# EAGLE design waterLevelController (EAGLE 9.6.2)
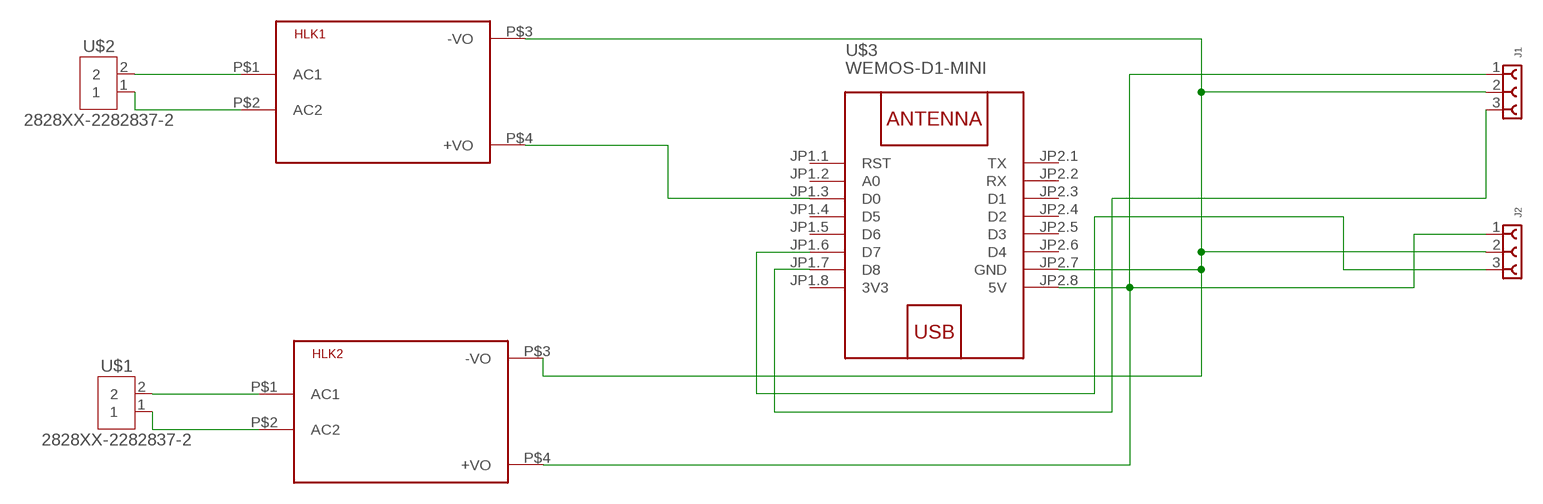
[diagram p0: schematic, sheet 1]

## Parts
HLK1  HLK-PM013W  [HLK-PM01]
HLK2  HLK-PM013W  [HLK-PM01]
J1  6130XX11821_61300311821  [61300311821]
J2  6130XX11821_61300311821  [61300311821]
U$1  2828XX-2282837-2  [TERMBLK_508-2N]
U$2  2828XX-2282837-2  [TERMBLK_508-2N]
U$3  WEMOS-D1-MINI  [WEMOS-D1-MINI]

## Nets
N$1: HLK1.P$2(AC2) U$2.1
N$2: HLK2.P$4(+VO) J1.1 J2.1 U$3.JP2.8(5V)
N$3: HLK1.P$1(AC1) U$2.2
N$4: HLK1.P$3(-VO) HLK2.P$3(-VO) J1.2 J2.2 U$3.JP2.7(GND)
N$5: HLK2.P$2(AC2) U$1.1
N$6: HLK2.P$1(AC1) U$1.2
N$7: HLK1.P$4(+VO) U$3.JP1.3(D0)
N$8: J1.3 U$3.JP1.7(D8)
N$9: J2.3 U$3.JP1.6(D7)
Unconnected: U$3.JP1.1(RST) U$3.JP1.2(A0) U$3.JP1.4(D5) U$3.JP1.5(D6) U$3.JP2.1(TX) U$3.JP2.2(RX) U$3.JP2.3(D1) U$3.JP2.4(D2) U$3.JP2.5(D3) U$3.JP2.6(D4)

## Power pins joined to a net without a drawn wire
3V3: U$3.JP1.8(3V3)

## Library data of the parts
HLK1 HLK2 = module:HLK-PM01: Hi-Link Power Supply HLK-PM01 3W Author: Ahmed Said <https://github.com/AhmedSaid/EAGLELibraries>
J1 J2 = Wurth_Connectors_WR-PHD:6130XX11821_61300311821: WR-PHD 2.54 mm Socket Header ARTICLE PROPERTIES: Pins:1;​ 2;​ 3;​ 4;​ 5;​ 6;​ 7;​ 8;​ 9;​ 10;​ 12;​ 13;​ 14;​ 15;​ 16;​ 18;​ 20;​ 22;​ 24;​ 25;​ 32;​ 36;​ 40 KIND PROPERTIES: Pitch：2.54 mm Quality Class:3 as per CECC 75 301-802 Rows：Single Gender：Socket Header;​ Female Type：Straight MATERIAL PROPERTIES: Insulator Material :PBT Insulator Flammability Rating:UL94 V-0 Contact Material:Copper Alloy Contact Plating:Gold Contact Type:Stamped GENERAL INFORMATION Operating Temperature:-40 up to +125 °C Compliance:Lead free / RoHS ELECTRICAL PROPERTIES: Rated Current:3 A IR 1:3 A Withstanding Voltage:500 V (AC) Contact Resistance:20 mΩ RISO:1000 MΩ CERTIFICATION UL Approval:E323964 PACKAGING PROPERTIES Packaging:Tray <https://katalog.we-online.com/media/images/v2/o33218v209%20Family_WR-PHD_613xxx11821.jpg> Details see: https://katalog.we-online.com/en/em/PHD_2_54_SOCKET_HEADER_6130XX11821 Updated by Yingchun,Shan 2019-10-21 2019 (C) Würth Elektronik; DATASHEET-URL: https://katalog.we-online.com/em/datasheet/61300311821.pdf; GENDER: Socket Header; IR: 3A; MATES: WR-PHD 2.54mm SMT Pin Header/THT Angled Pin Header/THT Pin Header; PACKAGING: Tray; PART-NUMBER: 61300311821; PINS: 3; ROWS: Single; TYPE: Straight
U$1 U$2 = Connector:2828XX-2: 2 Position Wire to Board Terminal Block Horizontal with Board Datasheet <https://www.te.com.cn/commerce/DocumentDelivery/DDEController?Action=showdoc&DocId=Catalog+Section%7F1308389_EUROSTYLE_TERMINAL_BLOCKS%7F0607%7Fpdf%7FEnglish%7FENG_CS_1308389_EUROSTYLE_TERMINAL_BLOCKS_0607.pdf%7F2-282837-5>; CATEGORY: Connector; DESCRIPTION: 2 Position Wire to Board Terminal Block Horizontal with Board 5.08 mm Through Hole; MANUFACTURER: TE Connectivity; MPN: 282837-2; OPERATING_TEMPERATURE: -40°C to +105°C; PART_STATUS: ACTIVE; ROHS_COMPLIANCE: RoHS Compliant; SERIES: 282837; SUBCATEGORY: Terminal Block; TYPE: Side Wire Entry
U$3 = diy-modules:WEMOS-D1-MINI: WEMOS D1 mini: Mini Wi-Fi Board based on ESP-8266 device More details can be found here: https://www.wemos.cc/product/d1-mini.html Click here to find device on ebay.com <http://www.ebay.com/sch/wemos+d1+mini+nodemcu>

## Board
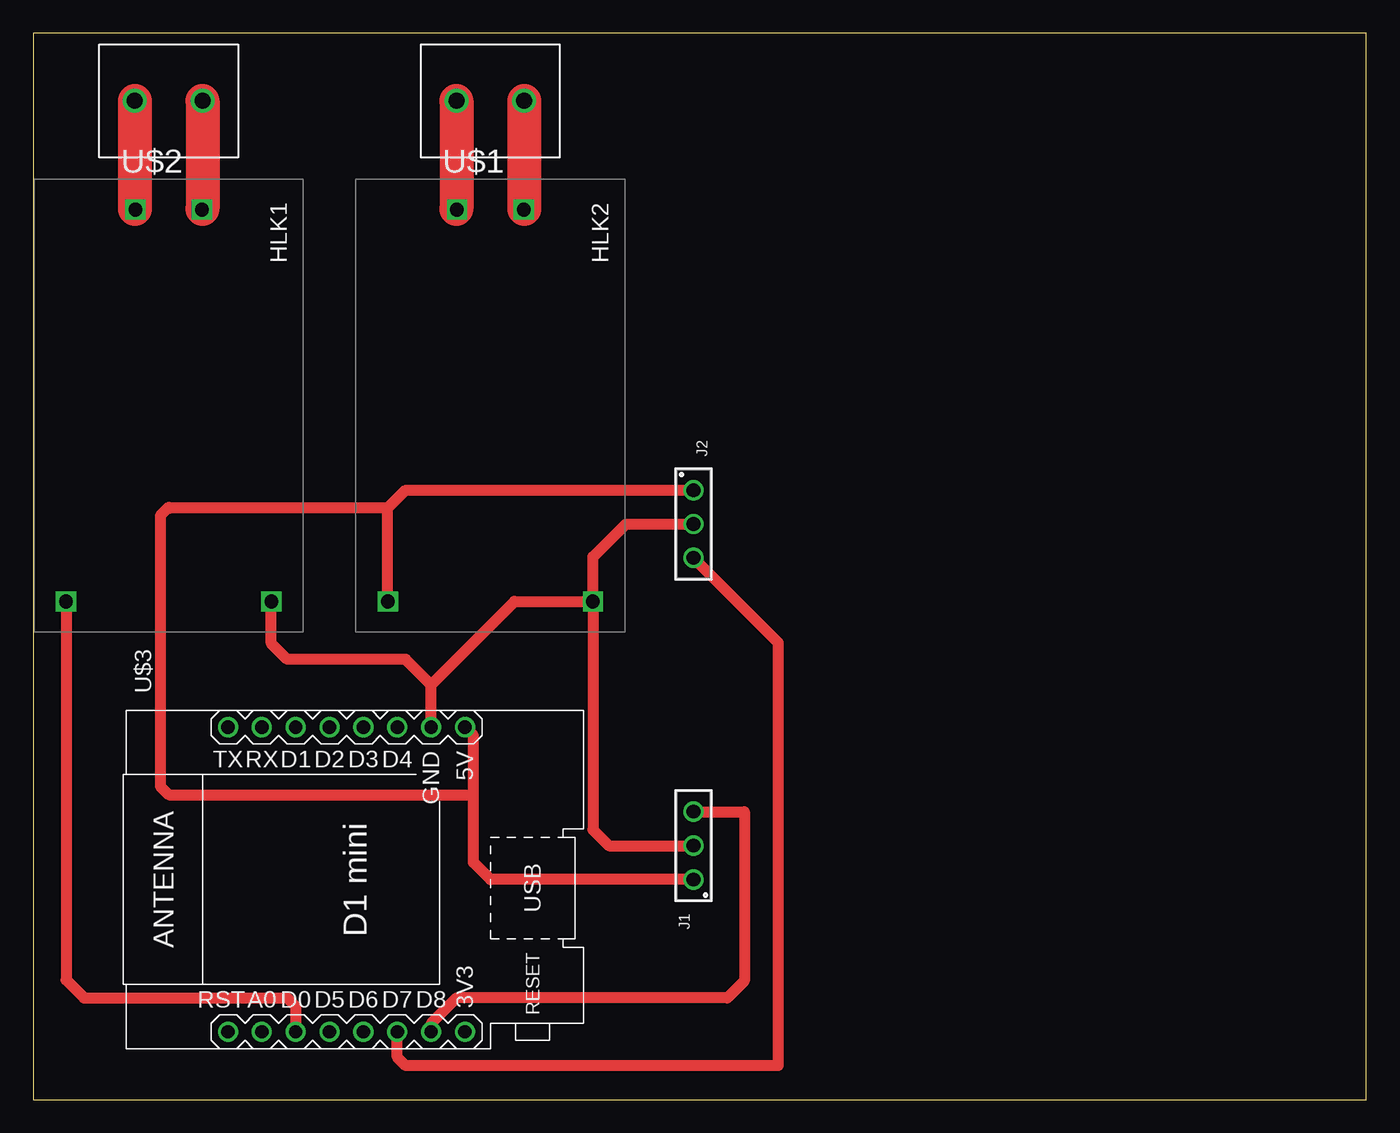
[diagram p1: board, top side]

Size 100 x 80 mm. Coordinates in mm from the lower left corner, seen from the top.
Outline: 0,0 100,0 100,80 0,80 0,0
Copper layers (1*16): Top 0.035mm / dielectric 1.5mm / Bottom 0.035mm
Design rules "default": minimum track width 6mil, minimum drill 0.35mm, track to track 6mil, track to pad 6mil, pad to pad 6mil, via to via 6mil, smd to smd 6mil, copper to edge 40mil, drill to drill 6mil, minimum pad ring 10mil, minimum via ring 8mil, stop-mask expansion 4mil, vias tented up to drill 0mil, thermal gap 10mil

### Footprints (pad centres in the part's own frame; a part is rotated, then mirrored left to right if it is on the bottom)
HLK-PM01 = drill 1.016 square: P$1 -14.7,2.5; P$2 -14.7,-2.5; P$3 14.7,7.7; P$4 14.7,-7.7
61300311821 = drill 1.02: 1 -2.54,0; 2 0,0; 3 2.54,0
TERMBLK_508-2N = drill 1.2: 1 0,0; 2 5.08,0
WEMOS-D1-MINI = drill 1: JP1.1 -11.43,9.525; JP1.2 -11.43,6.985; JP1.3 -11.43,4.445; JP1.4 -11.43,1.905; JP1.5 -11.43,-0.635; JP1.6 -11.43,-3.175; JP1.7 -11.43,-5.715; JP1.8 -11.43,-8.255; JP2.1 11.43,9.525; JP2.2 11.43,6.985; JP2.3 11.43,4.445; JP2.4 11.43,1.905; JP2.5 11.43,-0.635; JP2.6 11.43,-3.175; JP2.7 11.43,-5.715; JP2.8 11.43,-8.255

### Placement (x,y rotation side)
HLK1  10.16,52.07 270 top
HLK2  34.29,52.07 270 top
J1  49.53,19.05 90 top
J2  49.53,43.18 270 top
U$1  31.75,74.93 0 top
U$2  7.62,74.93 0 top
U$3  24.13,16.51 90 top

### Tracks (layer width: path | path; a pad name or v marks a point on that pad's centre or on a via)
N$1
  Top 0.152: 7.62,66.83 HLK1.P$2
  Top 2.54: U$2.1 7.62,66.83
N$2
  Top 0.813: HLK2.P$4 26.59,44.37 | 26.59,44.37 27.94,45.72 J2.1 | 26.59,44.37 10.24,44.37 10.16,44.45 9.53,43.81 9.53,23.5 10.16,22.86 33.02,22.86 | 33.02,22.86 33.02,27.3 U$3.JP2.8 | J1.1 34.29,16.51 33.02,17.78 33.02,22.86
N$3
  Top 0.152: 12.7,66.83 HLK1.P$1
  Top 2.54: U$2.2 12.7,66.83
N$4
  Top 0.813: U$3.JP2.7 29.84,31.11 | HLK2.P$3 36.1,37.37 29.84,31.11 | HLK2.P$3 41.99,40.72 44.45,43.18 J2.2 | HLK2.P$3 41.99,20.24 43.18,19.05 J1.2 | 29.84,31.11 27.94,33.02 19.05,33.02 17.86,34.21 HLK1.P$3
N$5
  Top 0.152: 31.75,66.83 HLK2.P$2
  Top 2.54: U$1.1 31.75,66.83
N$6
  Top 0.152: 36.83,66.83 HLK2.P$1
  Top 2.54: U$1.2 36.83,66.83
N$7
  Top 0.813: HLK1.P$4 2.46,8.97 3.81,7.62 19.05,7.62 19.68,6.99 U$3.JP1.3
N$8
  Top 0.813: J1.3 53.34,21.59 53.34,8.89 52.07,7.62 31.75,7.62 29.84,5.71 U$3.JP1.7
N$9
  Top 0.813: J2.3 55.88,34.29 55.88,2.54 27.94,2.54 27.3,3.17 U$3.JP1.6